# Altium project CGRA_Board_2.PrjPcb (part 2 of 3)

## Sheet USB.SchDoc
size B; Organization: Altium Limited; Address1: L3, 12a Rodborough Rd; Address2: Frenchs Forest; Address3: NSW; Address4: Australia 2086
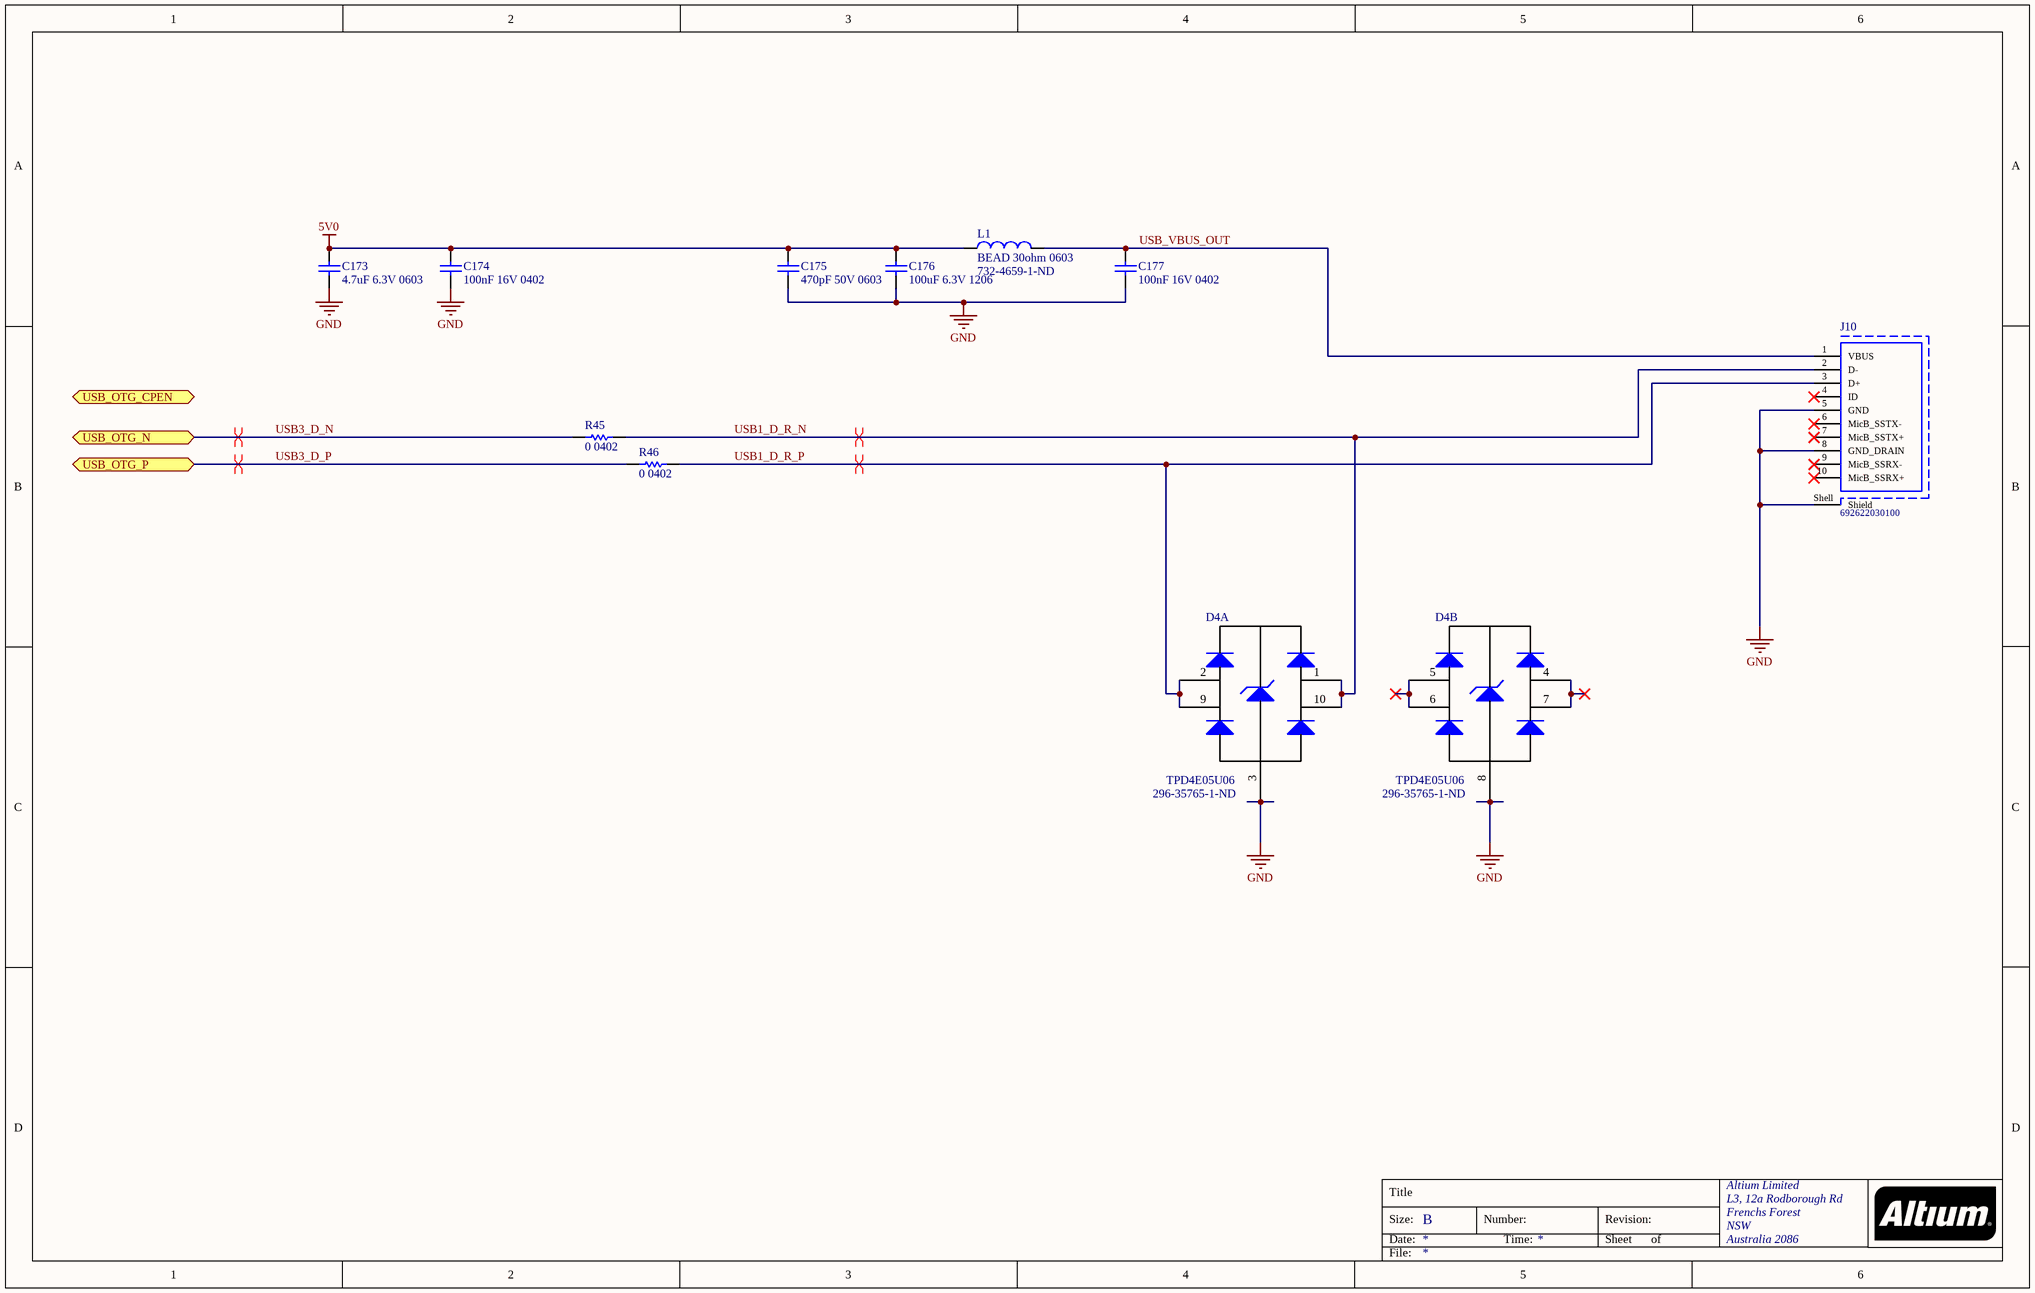
[diagram p7: USB.SchDoc]

### Parts
C173  4.7uF 6.3V 0603  [CAPC0603(1608)55_M]
C174  100nF 16V 0402  [CAPC0402(1005)60_M]
C175  470pF 50V 0603  [CAPC0603(1608)100_M]
C176  100uF 6.3V 1206  [CAPC1206(3216)190_L]
C177  100nF 16V 0402  [CAPC0402(1005)60_M]
D4  TPD4E05U06  Supplier Part Number 1: 296-35765-1-ND  [TI R-PUSON-N10]  (parts A,B of 2)
J10  692622030100  [692622030100]
L1  BEAD 30ohm 0603  Supplier Part Number 1: 732-4659-1-ND  [WE BEAD 0603 INDC1608X10N]
R45  0 0402  [RESC0402(1005)_N]
R46  0 0402  [RESC0402(1005)_N]

### Ports
USB_OTG_CPEN (bidir), USB_OTG_N (bidir), USB_OTG_P (bidir)

### Nets
5V0: C173.2 C174.2 C175.2 C176.2 L1.1
GND: C173.1 C174.1 C175.1 C176.1 C177.1 D4.3 D4.8 J10.5(GND) J10.8(GND_DRAIN) J10.Shell(Shield)
USB1_D_R_N: D4.1 D4.10 J10.2(D-) R45.2
USB1_D_R_P: D4.2 D4.9 J10.3(D+) R46.2
USB3_D_N: R45.1 ; port USB_OTG_N
USB3_D_P: R46.1 ; port USB_OTG_P
USB_VBUS_OUT: C177.2 J10.1(VBUS) L1.2
NetD4_4: D4.4 D4.7
NetD4_5: D4.5 D4.6

Not connected (* = marked no-connect by the designer): J10 4(ID)* 6(MicB_SSTX-)* 7(MicB_SSTX+)* 9(MicB_SSRX-)* 10(MicB_SSRX+)*

### Layout directives
differential pair: USB1_D_R_N, USB1_D_R_P, USB3_D_N, USB3_D_P

### Notes on the sheet
- Title
- Size:
- Date:
- B
- Number:
- Time:
- Revision:
- Sheet
- of
- File:

### Library data of the parts
C173 = CMP-1035-02779-1: CAP 4.7uF 6.3V ±10% 0603 (1608 Metric) Thickness 0.55mm SMD; Case-Metric: 1608; Case-EIA: 0603; Tolerance: Â±10%; Technology: SMT; Value: 4.7uF; Max Thickness: 0.55 mm; Rated Voltage: 6.3 V
C174 C177 = CMP-1034-02069-1: CAP 100nF 16V ±10% 0402 (1005 Metric) Thickness 0.6mm SMD; Case-EIA: 0402; Case-Metric: 1005; Tolerance: Â±10%; Value: 100nF; Max Thickness: 0.6 mm; Rated Voltage: 16 V; Technology: SMT
C175 = CMP-1035-01675-1: CAP 470pF 50V ±5% 0603 (1608 Metric) Thickness 1mm SMD; Case-Metric: 1608; Tolerance: Â±5%; Case-EIA: 0603; Technology: SMT; Rated Voltage: 50 V; Max Thickness: 1 mm; Value: 470pF
C176 = CMP-1037-05005-1: CAP 100uF 6.3V ±20% 1206 (3216 Metric) Thickness 1.9mm SMD; Tolerance: Â±20%; Case-EIA: 1206; Case-Metric: 3216; Technology: SMT; Max Thickness: 1.9 mm; Rated Voltage: 6.3 V; Value: 100uF
D4 = TPD4E05U06: 4-Channel ESD Protection Diode; Supplier 1: Digi-Key
J10 = CMP-1502-03225-1: Micro USB 3.0 Type B Receptacle WR-COM, Horizontal, SMT, with Pads; Manufacturer: Wurth Elektronik; Contact Resistance: 50mOhm; Rated Current: 0.25A; Working Voltage: 30VAC; Manufacturer URL: http://www.we-online.de; Connector Type: MicroUSB3.0TypeB; Gender: Receptacle; Part Number: 692622030100; Mounting Technology: SMT; Packaging: TapeandReel; Publisher: WurthElektronik; Orientation: Horizontal; Package Reference: 692622030100; Operating Temperature: -20to85degC; Datasheet URL: https://katalog.we-online.de/em/datasheet/692622030100.pdf
L1 = BEAD 30ohm 0603: Ferrite bead, 30ohm @ 100MHz; Supplier 1: Digi-Key
R45 R46 = CMP-1011-00001-1: Jumper 0402 (1005 Metric); Tolerance: None; Case-Metric: 1005; Case-EIA: 0402; Value: 0.00 Ohm; Power: None; Technology: SMT

## Sheet ETH_microSD.SchDoc
size B; Organization: Altium Limited; Address1: L3, 12a Rodborough Rd; Address2: Frenchs Forest; Address3: NSW; Address4: Australia 2086
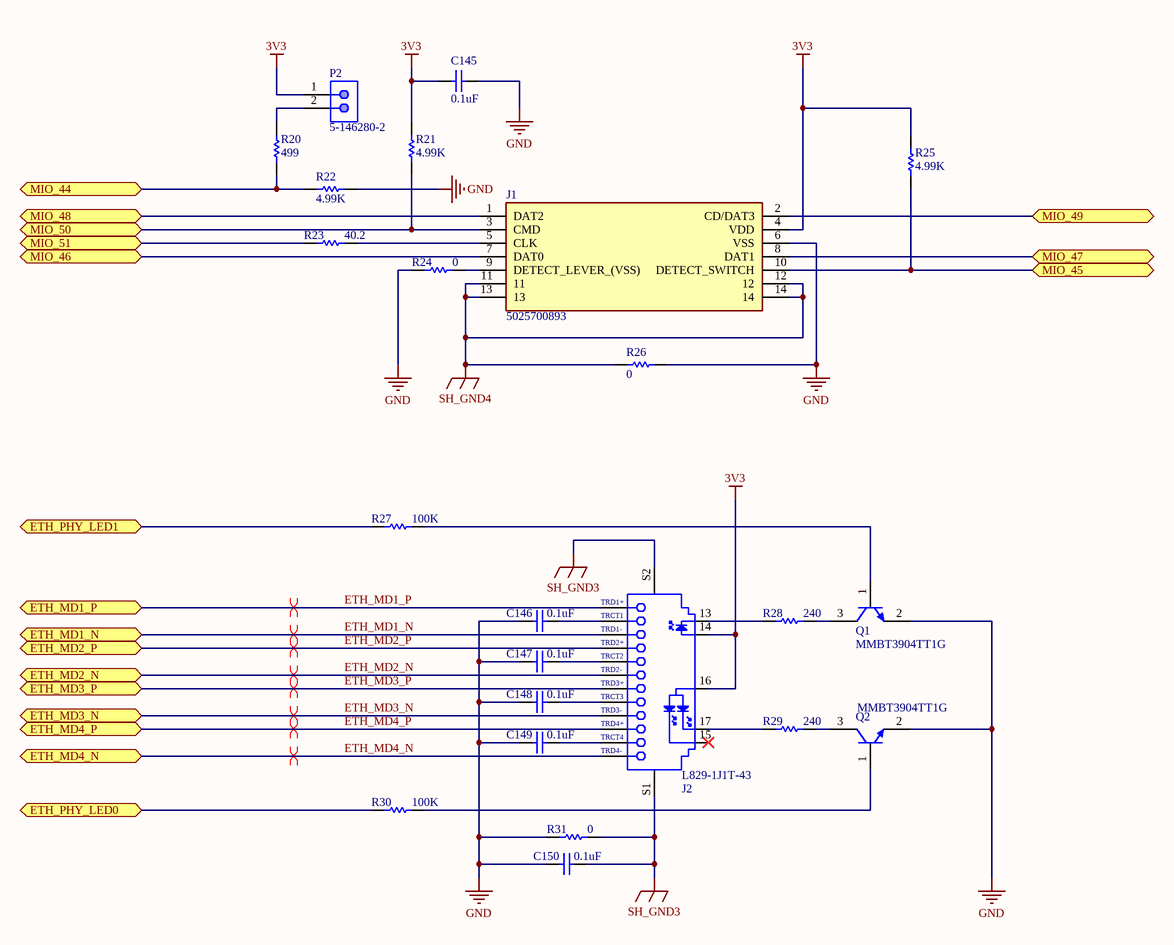
[diagram p8: ETH_microSD.SchDoc]

### Parts
C145  0.1uF  [CAPC0201(0603)33_N]
C146  0.1uF  [CAPC0201(0603)33_N]
C147  0.1uF  [CAPC0201(0603)33_N]
C148  0.1uF  [CAPC0201(0603)33_N]
C149  0.1uF  [CAPC0201(0603)33_N]
C150  0.1uF  [CAPC0201(0603)33_N]
J1  5025700893  [5025700893]
J2  L829-1J1T-43  [BELS-L829-1J1T-43_V]
P2  5-146280-2  [TECO-5-146280-2_V]
Q1  MMBT3904TT1G  [ONSC-SC-75-3-463-01_V]
Q2  MMBT3904TT1G  [ONSC-SC-75-3-463-01_V]
R20  499  [RESC0402(1005)_N]
R21  4.99K  [RESC0402(1005)_N]
R22  4.99K  [RESC0402(1005)_N]
R23  40.2  [RESC0402(1005)_N]
R24  0  [RESC0402(1005)_N]
R25  4.99K  [RESC0402(1005)_N]
R26  0  [RESC0402(1005)_N]
R27  100K  [RESC0402(1005)_N]
R28  240  [RESC0402(1005)_N]
R29  240  [RESC0402(1005)_N]
R30  100K  [RESC0402(1005)_N]
R31  0  [RESC0402(1005)_N]

### Ports
ETH_MD1_N (bidir), ETH_MD1_P (bidir), ETH_MD2_N (bidir), ETH_MD2_P (bidir), ETH_MD3_N (bidir), ETH_MD3_P (bidir), ETH_MD4_N (bidir), ETH_MD4_P (bidir), ETH_PHY_LED0 (bidir), ETH_PHY_LED1 (bidir), MIO_44 (bidir), MIO_45 (bidir), MIO_46 (bidir), MIO_47 (bidir), MIO_48 (bidir), MIO_49 (bidir), MIO_50 (bidir), MIO_51 (bidir)

### Nets
3V3: C145.1 J1.4(VDD) J2.14 J2.16 P2.1 R21.2 R25.2
GND: C145.2 C146.1 C147.1 C148.1 C149.1 C150.1 J1.6(VSS) Q1.2(E) Q2.2(E) R22.2 R24.1 R26.2 R31.1
SH_GND3: C150.2 J2.S1 J2.S2 R31.2
SH_GND4: J1.11 J1.12 J1.13 J1.14 R26.1
ETH_MD1_N: J2.3(TRD1-) ; port ETH_MD1_N
ETH_MD1_P: J2.1(TRD1+) ; port ETH_MD1_P
ETH_MD2_N: J2.6(TRD2-) ; port ETH_MD2_N
ETH_MD2_P: J2.4(TRD2+) ; port ETH_MD2_P
ETH_MD3_N: J2.9(TRD3-) ; port ETH_MD3_N
ETH_MD3_P: J2.7(TRD3+) ; port ETH_MD3_P
ETH_MD4_N: J2.12(TRD4-) ; port ETH_MD4_N
ETH_MD4_P: J2.10(TRD4+) ; port ETH_MD4_P
NetC146_2: C146.2 J2.2(TRCT1)
NetC147_2: C147.2 J2.5(TRCT2)
NetC148_2: C148.2 J2.8(TRCT3)
NetC149_2: C149.2 J2.11(TRCT4)
NetJ1_1: J1.1(DAT2) ; port MIO_48
NetJ1_2: J1.2(CD/DAT3) ; port MIO_49
NetJ1_3: J1.3(CMD) R21.1 ; port MIO_50
NetJ1_5: J1.5(CLK) R23.2
NetJ1_7: J1.7(DAT0) ; port MIO_46
NetJ1_8: J1.8(DAT1) ; port MIO_47
NetJ1_9: J1.9(DETECT_LEVER_(VSS)) R24.2
NetJ1_10: J1.10(DETECT_SWITCH) R25.1 ; port MIO_45
NetJ2_13: J2.13 R28.1
NetJ2_17: J2.17 R29.1
NetJ8_52: R27.1 ; port ETH_PHY_LED1
NetJ8_53: R30.1 ; port ETH_PHY_LED0
NetJ8_93: R20.1 R22.1 ; port MIO_44
NetJ8_100: R23.1 ; port MIO_51
NetP2_2: P2.2 R20.2
NetQ1_1: Q1.1(B) R27.2
NetQ1_3: Q1.3(C) R28.2
NetQ2_1: Q2.1(B) R30.2
NetQ2_3: Q2.3(C) R29.2

Not connected (* = marked no-connect by the designer): J2 15*

### Layout directives
differential pair: ETH_MD1_N, ETH_MD1_P, ETH_MD2_N, ETH_MD2_P, ETH_MD3_N, ETH_MD3_P, ETH_MD4_N, ETH_MD4_P

### Notes on the sheet
- Title
- Size:
- Date:
- B
- Number:
- Time:
- Revision:
- Sheet
- of
- File:

### Library data of the parts
C145-C150 = CAP_0201
J1 = 5025700893: Connector; Manufacturer_Name: Molex; Datasheet Link: https://www.molex.com/pdm_docs/sd/5025700893_sd.pdf; Height: 1mm; Manufacturer_Part_Number: 5025700893
J2 = CMP-1715-00001-1: Gigabit MagJack(R) Ultra Low Profile, 10/100/1000 Base-T, 19-Pin THD, RoHS, Tray; Width: 24.13 mm; RoHSCompliant: True; PartNumber: L829-1J1T-43; Case/Package: Metal; Mount: Through Hole; ComponentLink1Description: Manufacturer URL; Height: 11.3 mm; Package Quantity: 60; Packaging: Tray; Length: 17.78 mm; PackageDescription: 19-Pin Through Hole Device, Body 23.94 x 17.58 mm, Pitch 2.03 mm; ComponentLink2URL: http://belfuse.com/pdfs/L829-1J1T-43.pdf; ComponentLink1URL: http://belfuse.com/ethernet/; Mounting Technology: Through Hole; DatasheetVersion: Rev. G; Pins: 8; ComponentLink2Description: Datasheet
P2 = CMP-2000-07492-1: Male Header, Pitch 2.54 mm, 1 x 2 Position, Height 8.21 mm, Tail Length 3.05 mm, -65 to 105 degC, RoHS, Bulk; Manufacturer: TE Connectivity; Mating Connector Lock: No(Without); Number of Positions: 2; Pitch: 2.54mm; PCB Mounting Orientation: Vertical; Keyed: No; Case\/Package: 100; Mating Post Length: 0.23inch; High Temperature Housing: Yes; Max Current Rating: 5A; PCB Thickness: 0.063inch; PCB Mount Retention: Without; Approvals: CSA; Current Rating: 3A; Radiation Hardening: No; Length: 4.67mm; Contact Mating Length: 0.23inch; Connector Type: Header; Number of Rows: 1; Termination Post Length: 0.12inch; Board Standoff: No(Without); Max Operating Temperature: 105degC; Contact Shape: Square; Selectively Loaded: No(Without); Gasket: No(Without); Number of Contacts: 2; Contact Gender: Male; Mating Alignment: No(Without); Manufacturer URL: http://www.te.com/; Datasheet URL: http://www.te.com/commerce/DocumentDelivery/DDEController?Action=showdoc&DocId=Customer+Drawing%7F146280%7FH1%7Fpdf%7FEnglish%7FENG_CD_146280_H1.pdf%7F5-146280-2; Mount: ThroughHole; Orientation: Straight; Packaging: Carton; Package Reference: 5-146280-2; Package Quantity: 500; Stabilizers: No(Without); Row Spacing: 2.54mm; Contact Material: CopperAlloy; Panel Mount Retention: No(Without); Datasheet Version: Rev. H1, 08/2016; Housing Colour: Black; Colour: Black; Package Description: Male Header, Pitch 2.54 mm, 1 x 2 Position, Height 8.21 mm, Tail Length 3.05 mm; Contact Plating: Matte; Housing Material: Polymer; Contact Protection: No(Without); Min Operating Temperature: -65degC; Mounting Technology: ThroughHole; Flammability Rating: UL94V-0; RoHSCompliant: true; Termination: ThroughHole; Depth: 2.34mm; High Speed Serial Data Connector: No
Q1 Q2 = CMP-1048-00420-1: General Purpose Transistor, NPN Silicon, 3-Pin SC-75, Pb-Free, Tape and Reel; Manufacturer: On Semiconductor; IC Continuous (A): 0.2; fT Min (MHz): 300; ComponentLink3URL: http://www.onsemi.com/pub_link/Collateral/463-01.PDF; DatasheetVersion: Rev. 5; RoHS: TRUE; Mounting Technology: Surface Mount; ComponentLink1URL: http://www.onsemi.com/; ComponentLink3Description: Package Specification; PackageReference: SC-75-3-463-01; Polarity: NPN; ComponentLink2Description: Datasheet; PackageVersion: Rev. F, 07/2005; PartNumber: MMBT3904TT1G; ComponentLink2URL: http://www.onsemi.cn/pub_link/Collateral/MMBT3904TT1-D.PDF; ComponentLink1Description: Manufacturer URL; PackageDescription: 3-Pin Small Outline Transistor, Body 1.6 x 0.8 mm, Pitch 0.5 mm; Packing: Tape and Reel
R20-R31 = RES_0402

## Sheet Display_port.SchDoc
size B; Organization: Altium Limited; Address1: L3, 12a Rodborough Rd; Address2: Frenchs Forest; Address3: NSW; Address4: Australia 2086
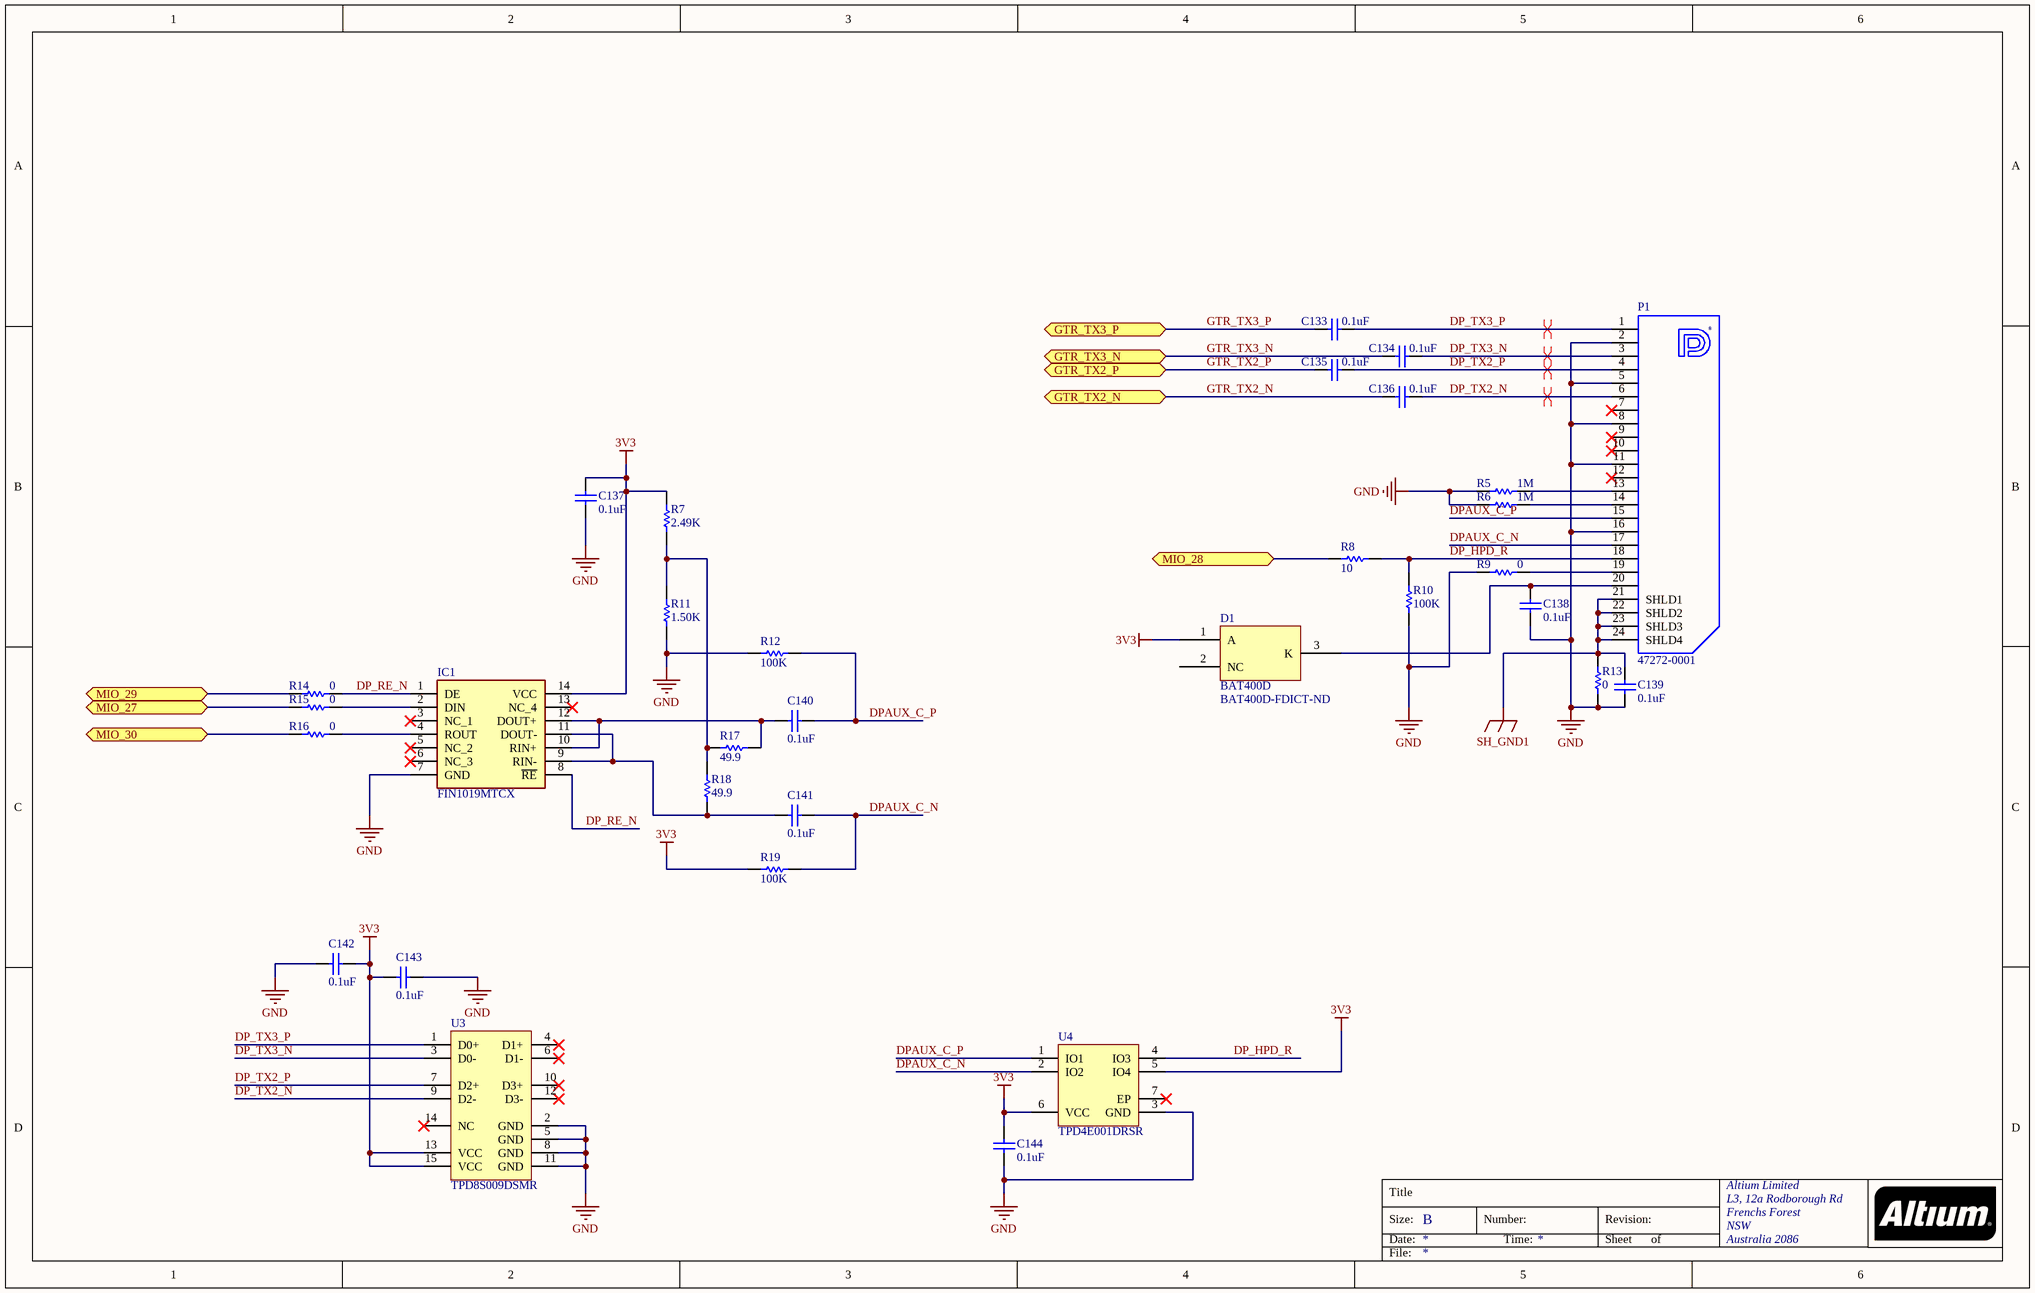
[diagram p9: Display_port.SchDoc]

### Parts
C133  0.1uF  [CAPC0201(0603)33_N]
C134  0.1uF  [CAPC0201(0603)33_N]
C135  0.1uF  [CAPC0201(0603)33_N]
C136  0.1uF  [CAPC0201(0603)33_N]
C137  0.1uF  [CAPC0201(0603)33_N]
C138  0.1uF  [CAPC0201(0603)33_N]
C139  0.1uF  [CAPC0201(0603)33_N]
C140  0.1uF  [CAPC0201(0603)33_N]
C141  0.1uF  [CAPC0201(0603)33_N]
C142  0.1uF  [CAPC0201(0603)33_N]
C143  0.1uF  [CAPC0201(0603)33_N]
C144  0.1uF  [CAPC0201(0603)33_N]
D1  BAT400D  Supplier Part Number 1: BAT400D-FDICT-ND  [SOT95P236X110-3N]
IC1  FIN1019MTCX  [SOP65P640X120-14N]
P1  47272-0001  [MOLX-47272-0001_V]
R5  1M  [RESC0402(1005)_N]
R6  1M  [RESC0402(1005)_N]
R7  2.49K  [RESC0402(1005)_N]
R8  10  [RESC0402(1005)_N]
R9  0  [RESC0402(1005)_N]
R10  100K  [RESC0402(1005)_N]
R11  1.50K  [RESC0402(1005)_N]
R12  100K  [RESC0402(1005)_N]
R13  0  [RESC0402(1005)_N]
R14  0  [RESC0402(1005)_N]
R15  0  [RESC0402(1005)_N]
R16  0  [RESC0402(1005)_N]
R17  49.9  [RESC0402(1005)_N]
R18  49.9  [RESC0402(1005)_N]
R19  100K  [RESC0402(1005)_N]
U3  TPD8S009DSMR  [DSM0015A_V]
U4  TPD4E001DRSR  [DRS0006A_V]

### Ports
GTR_TX2_N (bidir), GTR_TX2_P (bidir), GTR_TX3_N (bidir), GTR_TX3_P (bidir), MIO_27 (bidir), MIO_28 (bidir), MIO_29 (bidir), MIO_30 (bidir)

### Nets
3V3: C137.2 C142.1 C143.2 C144.2 D1.1(A) IC1.14(VCC) R7.2 R19.2 U3.13(VCC) U3.15(VCC) U4.5(IO4) U4.6(VCC)
GND: C137.1 C138.1 C139.1 C142.2 C143.1 C144.1 IC1.7(GND) P1.2 P1.5 P1.8 P1.11 P1.16 R5.1 R6.1 R9.1 R10.1 R11.1 R12.2 R13.2 U3.2(GND) U3.5(GND) U3.8(GND) U3.11(GND) U4.3(GND)
SH_GND1: C139.2 P1.21(SHLD1) P1.22(SHLD2) P1.23(SHLD3) P1.24(SHLD4) R13.1
DP_HPD_R: P1.18 R8.2 R10.2 U4.4(IO3)
DP_RE_N: IC1.1(DE) IC1.8(~{RE}) R14.1
DP_TX2_N: C136.2 P1.6 U3.9(D2-)
DP_TX2_P: C135.2 P1.4 U3.7(D2+)
DP_TX3_N: C134.2 P1.3 U3.3(D0-)
DP_TX3_P: C133.2 P1.1 U3.1(D0+)
DPAUX_C_N: C141.2 P1.17 R19.1 U4.2(IO2)
DPAUX_C_P: C140.2 P1.15 R12.1 U4.1(IO1)
GTR_TX2_N: C136.1 ; port GTR_TX2_N
GTR_TX2_P: C135.1 ; port GTR_TX2_P
GTR_TX3_N: C134.1 ; port GTR_TX3_N
GTR_TX3_P: C133.1 ; port GTR_TX3_P
NetC138_2: C138.2 D1.3(K) P1.20
NetC140_1: C140.1 IC1.10(RIN+) IC1.12(DOUT+) R17.1
NetC141_1: C141.1 IC1.9(RIN-) IC1.11(DOUT-) R18.2
NetIC1_2: IC1.2(DIN) R15.1
NetIC1_4: IC1.4(ROUT) R16.1
NetJ8_70: R15.2 ; port MIO_27
NetJ8_71: R8.1 ; port MIO_28
NetJ8_72: R14.2 ; port MIO_29
NetJ8_73: R16.2 ; port MIO_30
NetP1_13: P1.13 R5.2
NetP1_14: P1.14 R6.2
NetP1_19: P1.19 R9.2
NetR7_1: R7.1 R11.2 R17.2 R18.1

Not connected (* = marked no-connect by the designer): D1 2(NC); IC1 3(NC_1)* 5(NC_2)* 6(NC_3)* 13(NC_4)*; P1 7* 9* 10* 12*; U3 4(D1+)* 6(D1-)* 10(D3+)* 12(D3-)* 14(NC)*; U4 7(EP)*

### Layout directives
differential pair: DP_TX2_N, DP_TX2_P, DP_TX3_N, DP_TX3_P

### Notes on the sheet
- Title
- Size:
- Date:
- B
- Number:
- Time:
- Revision:
- Sheet
- of
- File:
- (in symbol CMP-2000-05608-1) ®

### Library data of the parts
C133-C144 = CAP_0201
IC1 = FIN1019MTCX: Integrated Circuit; Manufacturer_Name: Fairchild Semiconductor; Datasheet Link: http://media.digikey.com/pdf/Data%20Sheets/Fairchild%20PDFs/FIN1019.pdf; Height: 1.2mm; Manufacturer_Part_Number: FIN1019MTCX; Mouser Part Number: 512-FIN1019MTCX; Mouser Price/Stock: https://www.mouser.com/Search/Refine.aspx?Keyword=512-FIN1019MTCX; RS Part Number: 8070805P; RS Price/Stock: http://uk.rs-online.com/web/p/products/8070805P
P1 = CMP-2000-05608-1: DisplayPort Connector, Pitch 0.5 mm, 1 x 20 Position, Height 6.65 mm, -20 to 85 degC, RoHS, Tape and Reel; Manufacturer: Molex; No. of Mating Cycles: 10000; Contact Resistance Max: 50mohm; Connector Mounting: PCB; Mating Force: 44.1N; Withstand Voltage: 500V; Voltage Rating V AC: 40V; Insulation Resistance: 10Mohm; Current Max: 0.5A; Gender: Receptacle; Contact Termination: SurfaceMountRightAngle; Mounting Orientation: Horizontal; De-mating Force: 9.8N; Contact Resistance: 30mohm; Pitch Spacing: 0.50mm; No. of Contacts: 20; Manufacturer URL: http://www.molex.com/; Datasheet Version: Rev. F, 06/2009; Package Description: DisplayPort Connector, Pitch 0.5 mm, 1 x 20 Position, Height 6.65 mm; Connector Type: DisplayPort; Package Reference: 47272-0001; Lead Spacing: 0.5mm; Datasheet URL: http://www.molex.com/pdm_docs/sd/472720001_sd.pdf; Operating Temperature Max: +85°C; Series: 47272; Flammability Rating: UL94V-0; Contact Plating: Gold; Operating Temperature Min: -20°C; Mounting Technology: SurfaceMount; Contact Material: CopperAlloy
R5-R19 = RES_0402
U3 = CMP-0326-00039-2: ESD Solution for HDMI / DisplayPort, 8 Channels, -40 to +85 degC, 15-pin SON (DSM); Manufacturer: Texas Instruments; Eco-Plan: TBD; IEC 61000-4-2 Air-Gap(+/- kV): 9; IO Capacitance(Typ)(pF): 0.8; IO Leakage Current(nA): 10; IEC 61000-4-2 Contact(+/- kV): 8; Differential Capacitance(pF): 0.05; ComponentLink1Description: Manufacturer URL; ComponentLink2URL: http://www.ti.com/general/docs/lit/getliterature.tsp?genericPartNumber=TPD8S009&fileType=pdf; PackageDescription: 15-Pin Plastic Small Outline Flat No-Lead, 2.5 x 6.5 x 0.8 mm Body, 0.5/1.5 mm Pitch; PackageReference: DSM0015A; ComponentLink2Description: Datasheet; PackageVersion: revA, Aug-2007; DatasheetVersion: SLVS816; SubFamily: ESD Solution; Breakdown Voltage(Min)(V): 9; Mounting Technology: Surface Mount; ComponentLink1URL: http://www.ti.com/; PartNumber: TPD8S009DSMR; ComponentLink3URL: SamplesURL:http://www.ti.com/product/tpd8s009#samples; ComponentLink3Description: URL Link1
U4 = CMP-0326-00041-3: Low-Capacitance + / - 15-kV ESD Protection Array for High-Speed Data Interfaces, 4 Channels, -40 to +85 degC, 6-pin SON (DRS), Green (RoHS & no Sb/Br); Manufacturer: Texas Instruments; IO Capacitance(Typ)(pF): 1.5; Breakdown Voltage(Min)(V): 11; Serial ATA / eSATA: TRUE; IEC 61000-4-2 Air-Gap(+/- kV): 15; SubFamily: ESD Solution; IEC 61000-4-2 Contact(+/- kV): 8; ComponentLink1URL: http://www.ti.com/; Eco-Plan: Green (RoHS & no Sb/Br); ComponentLink1Description: Manufacturer URL; PartNumber: TPD4E001DRSR; ComponentLink3Description: URL Link1; Mounting Technology: Surface Mount; PackageDescription: 6-Pin Plastic Small Outline No-Lead, 3 x 3 x 0.8 mm Body, 0.95 mm Pitch; ComponentLink3URL: SamplesURL:http://www.ti.com/product/tpd4e001#samples; 1394 / Firewire: TRUE; PackageVersion: revF, Jul-2011; PackageReference: DRS0006A; USB High Speed: TRUE; ComponentLink2Description: Datasheet; IO Leakage Current(nA): 1.5; ComponentLink2URL: http://www.ti.com/general/docs/lit/getliterature.tsp?genericPartNumber=TPD4E001&fileType=pdf; DatasheetVersion: SLLS682G
D1 = BAT400D: Supplier 1: Digi-Key

## Sheet Power_subsystem.SchDoc
size B; Organization: Altium Limited; Address1: L3, 12a Rodborough Rd; Address2: Frenchs Forest; Address3: NSW; Address4: Australia 2086
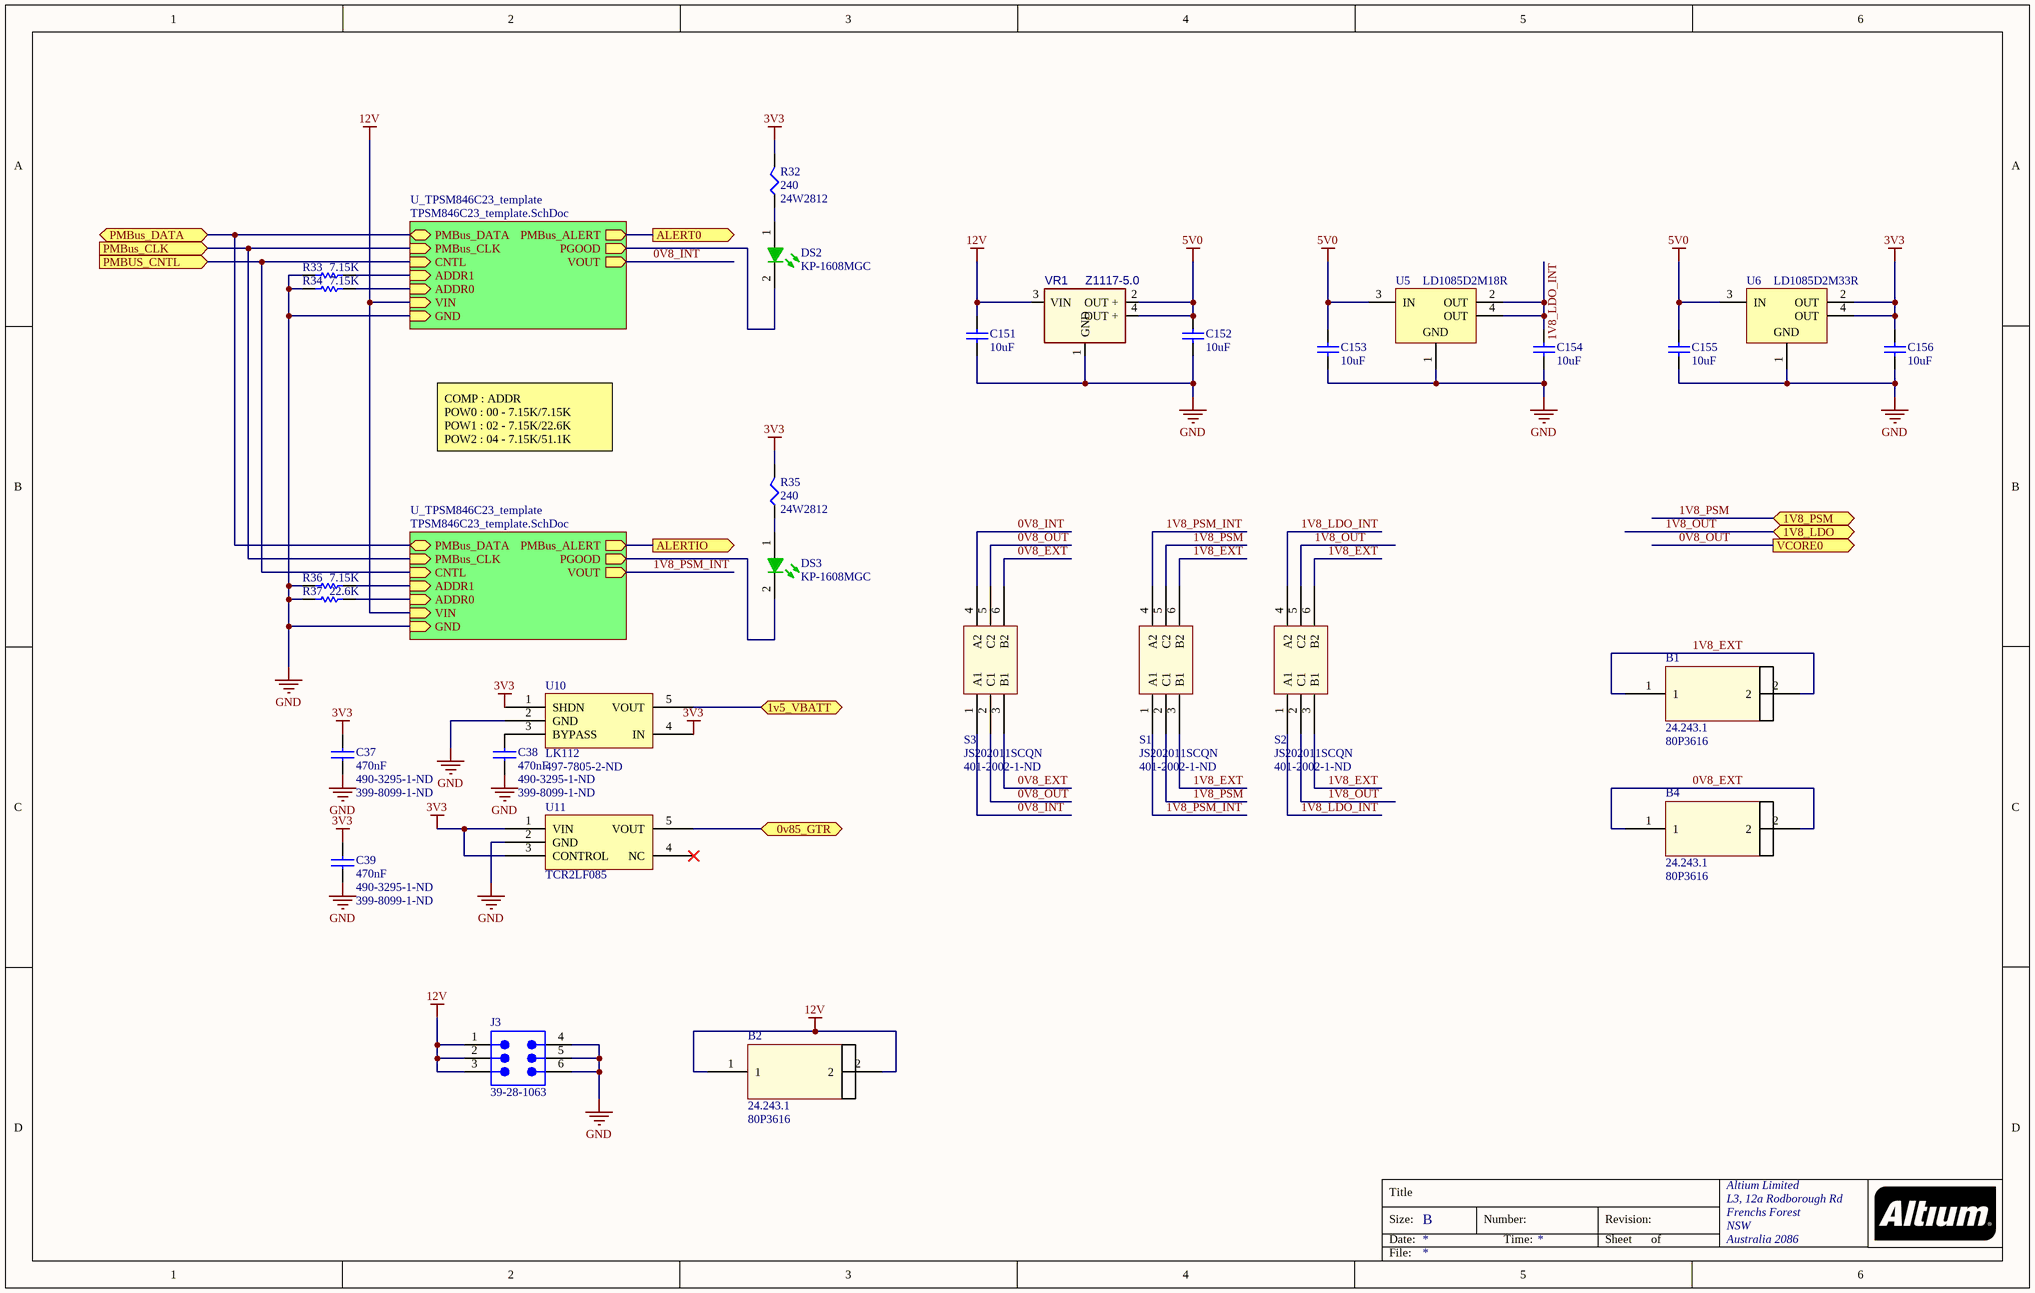
[diagram p10: Power_subsystem.SchDoc]

### Parts
B1  24.243.1  Supplier Part Number 1: 80P3616  [banana_clip]
B2  24.243.1  Supplier Part Number 1: 80P3616  [banana_clip]
B4  24.243.1  Supplier Part Number 1: 80P3616  [banana_clip]
C37  Capacitance: 470nF  Supplier Part Number 1: 490-3295-1-ND  Supplier Part Number 2: 399-8099-1-ND  [CAPC1005X06N]  (hidden comment: CAP_470nF_1608mm_0603mil_1)
C38  Capacitance: 470nF  Supplier Part Number 1: 490-3295-1-ND  Supplier Part Number 2: 399-8099-1-ND  [CAPC1005X06N]  (hidden comment: CAP_470nF_1608mm_0603mil_1)
C39  Capacitance: 470nF  Supplier Part Number 1: 490-3295-1-ND  Supplier Part Number 2: 399-8099-1-ND  [CAPC1005X06N]  (hidden comment: CAP_470nF_1608mm_0603mil_1)
C151  10uF  [CAPC0805(2012)145_N]
C152  10uF  [CAPC0805(2012)145_N]
C153  10uF  [CAPC0805(2012)145_N]
C154  10uF  [CAPC0805(2012)145_N]
C155  10uF  [CAPC0805(2012)145_N]
C156  10uF  [CAPC0805(2012)145_N]
DS2  KP-1608MGC  [KING-0603LED_GREEN_V]
DS3  KP-1608MGC  [KING-0603LED_GREEN_V]
J3  39-28-1063  [MOLX-39-28-1063_V]
R32  Resistance: 240  Supplier Part Number 1: 24W2812  [RESC1608X06N]  (hidden comment: RES_240_0603)
R33  7.15K  [RESC0402(1005)_N]
R34  7.15K  [RESC0402(1005)_N]
R35  Resistance: 240  Supplier Part Number 1: 24W2812  [RESC1608X06N]  (hidden comment: RES_240_0603)
R36  7.15K  [RESC0402(1005)_N]
R37  22.6K  [RESC0402(1005)_N]
S1  JS202011SCQN  Supplier Part Number 1: 401-2002-1-ND  [JS202011SCQN_auto]
S2  JS202011SCQN  Supplier Part Number 1: 401-2002-1-ND  [JS202011SCQN_auto]
S3  JS202011SCQN  Supplier Part Number 1: 401-2002-1-ND  [JS202011SCQN_auto]
U5  LD1085D2M18R  [D2PAK_A_M]
U6  LD1085D2M33R  [D2PAK_A_L]
U10  LK112  Supplier Part Number 1: 497-7805-2-ND  [SOT95P280X110-5N]
U11  TCR2LF085  [SOT95P280X110-5N]
VR1  Z1117-5.0  [SOT-223]

### Sub-sheets
U_TPSM846C23_template = TPSM846C23_template.SchDoc: PMBus_DATA (bidir), PMBus_CLK (in), PMBus_ALERT (out), CNTL (in), ADDR1 (in), ADDR0 (in), PGOOD (out), VIN (in), GND (in), VOUT (out)
U_TPSM846C23_template = TPSM846C23_template.SchDoc: PMBus_DATA (bidir), PMBus_CLK (in), PMBus_ALERT (out), CNTL (in), ADDR1 (in), ADDR0 (in), PGOOD (out), VIN (in), GND (in), VOUT (out)

### Ports
0v85_GTR (bidir), 1v5_VBATT (bidir), 1V8_LDO (bidir), 1V8_PSM (bidir), ALERT0 (out), ALERTIO (out), PMBus_CLK (in), PMBUS_CNTL (in), PMBus_DATA (bidir), VCORE0 (out)

### Nets
0V8_OUT: S3.2(C1) S3.5(C2) ; port VCORE0
1V8_OUT: S2.2(C1) S2.5(C2) ; port 1V8_LDO
1V8_PSM: S1.2(C1) S1.5(C2) ; port 1V8_PSM  [project net 1V8_PM]
3V3: C37.1 C39.1 C156.2 R32.1 R35.1 U6.2(OUT) U6.4(OUT) U10.1(SHDN) U10.4(IN) U11.1(VIN) U11.3(CONTROL)
5V0: C152.2 C153.2 C155.2 U5.3(IN) U6.3(IN) VR1.2(OUT_+) VR1.4(OUT_+)
12V: B2.1 B2.2 C151.2 J3.1 J3.2 J3.3 VR1.3(VIN) ; sheet U_TPSM846C23_template/VIN, sheet U_TPSM846C23_template/VIN
GND: C37.2 C38.2 C39.2 C151.1 C152.1 C153.1 C154.1 C155.1 C156.1 J3.4 J3.5 J3.6 R33.1 R34.1 R36.1 R37.1 U5.1(GND) U6.1(GND) U10.2(GND) U11.2(GND) VR1.1(GND) ; sheet U_TPSM846C23_template/GND, sheet U_TPSM846C23_template/GND
0V8_EXT: B4.1 B4.2 S3.3(B1) S3.6(B2)
0V8_INT: S3.1(A1) S3.4(A2) ; sheet U_TPSM846C23_template/VOUT
1V5_VBATT: U10.5(VOUT) ; port 1v5_VBATT
1V8_EXT: B1.1 B1.2 S1.3(B1) S1.6(B2) S2.3(B1) S2.6(B2)
1V8_LDO_INT: C154.2 S2.1(A1) S2.4(A2) U5.2(OUT) U5.4(OUT)
1V8_PSM_INT: S1.1(A1) S1.4(A2) ; sheet U_TPSM846C23_template/VOUT
ALERT0: port ALERT0, sheet U_TPSM846C23_template/PMBus_ALERT
ALERTIO: port ALERTIO, sheet U_TPSM846C23_template/PMBus_ALERT
GTR_VCC: U11.5(VOUT) ; port 0v85_GTR
PICO_MASTER_I2C_SCL: port PMBus_CLK, sheet U_TPSM846C23_template/PMBus_CLK, sheet U_TPSM846C23_template/PMBus_CLK
PICO_MASTER_I2C_SDA: port PMBus_DATA, sheet U_TPSM846C23_template/PMBus_DATA, sheet U_TPSM846C23_template/PMBus_DATA
PMBUS_CNTL: port PMBUS_CNTL, sheet U_TPSM846C23_template/CNTL, sheet U_TPSM846C23_template/CNTL
NetC38_1: C38.1 U10.3(BYPASS)
NetDS2_1: DS2.1(A) R32.2
NetDS2_2: DS2.2(K) ; sheet U_TPSM846C23_template/PGOOD
NetDS3_1: DS3.1(A) R35.2
NetDS3_2: DS3.2(K) ; sheet U_TPSM846C23_template/PGOOD
NetR33_2: R33.2 ; sheet U_TPSM846C23_template/ADDR1
NetR34_2: R34.2 ; sheet U_TPSM846C23_template/ADDR0
NetR36_2: R36.2 ; sheet U_TPSM846C23_template/ADDR1
NetR37_2: R37.2 ; sheet U_TPSM846C23_template/ADDR0

Not connected (* = marked no-connect by the designer): U11 4(NC)*

### Notes on the sheet
- COMP : ADDR
  POW0 : 00 - 7.15K/7.15K
  POW1 : 02 - 7.15K/22.6K
  POW2 : 04 - 7.15K/51.1K
- Title
- Size:
- Date:
- B
- Number:
- Time:
- Revision:
- Sheet
- of
- File:

### Library data of the parts
C37-C39 = CAP_470nF_1608mm_0603mil_1: 0.47uF Capacitor; Manufacturer: Murata; Manufacturer Part Number: GRM155R61E225ME15D; Voltage Rating: 25V; Tolerance: 20%; Dielectric: X5R; ComponentLink1URL: http://search.murata.co.jp/Ceramy/image/img/A01X/G101/ENG/GRM0335C1E120JA01-01.pdf; ComponentLink1Description: http://search.murata.co.jp/Ceramy/image/img/A01X/G101/ENG/GRM0335C1E120JA01-01.pdf; ComponentLink2URL: http://search.murata.co.jp/Ceramy/image/img/A01X/partnumbering_e_01.pdf; ComponentLink2Description: http://search.murata.co.jp/Ceramy/image/img/A01X/partnumbering_e_01.pdf; ComponentLink3URL: http://www1.futureelectronics.com/doc/SAMSUNG/CL03A104KQ3NNNC.pdf; ComponentLink3Description: http://www1.futureelectronics.com/doc/SAMSUNG/CL03A104KQ3NNNC.pdf; ComponentLink4URL: https://www.distrelec.biz/Web/Downloads/_e/ng/MLCC_CatalogDownload2013_ENG.pdf?mime=application%2Fpdf; ComponentLink4Description: https://www.distrelec.biz/Web/Downloads/_e/ng/MLCC_CatalogDownload2013_ENG.pdf?mime=application%2Fpdf; ComponentLink5URL: https://www.verical.com/server-webapp/html/getDatasheet?partID=355266; ComponentLink5Description: https://www.verical.com/server-webapp/html/getDatasheet?partID=355266; ComponentLink6URL: http://psearch.murata.com/capacitor/product/GCM155R71H103KA55%23.pdf; ComponentLink6Description: http://psearch.murata.com/capacitor/product/GCM155R71H103KA55%23.pdf; ComponentLink7URL: https://www.verical.com/server-webapp/html/getDatasheet?partID=27433; ComponentLink7Description: https://www.verical.com/server-webapp/html/getDatasheet?partID=27433; ComponentLink8URL: http://psearch.en.murata.com/capacitor/product/GCM155R71H103KA55%23.pdf; ComponentLink8Description: http://psearch.en.murata.com/capacitor/product/GCM155R71H103KA55%23.pdf; ComponentLink9URL: http://search.murata.co.jp/Ceramy/image/img/A01X/partnumbering_e_02.pdf; ComponentLink9Description: http://search.murata.co.jp/Ceramy/image/img/A01X/partnumbering_e_02.pdf; ComponentLink10URL: http://uk.rs-online.com/webdocs/0ef9/0900766b80ef92d0.pdf; ComponentLink10Description: http://uk.rs-online.com/webdocs/0ef9/0900766b80ef92d0.pdf; Stock 1: 100000; Pricing 1: 1=0.34, 10=0.23, 100=0.1163, 500=0.0796, 1000=0.07041, 2500=0.06735, 5000=0.06123 (USD); Mount: Surface Mount; Case/Package: 0402; Weight: 0.000212oz; Case Code (Metric): 1005; Case Code (Imperial): 0402; Min Operating Temperature: -55°C; Max Operating Temperature: 85°C; Packaging: Tape and Reel; Termination: SMD/SMT; Voltage Rating (DC): 25V; Package Quantity: 10000; Length: 0.039inch; Height: 0.5mm; Width: 0.02inch; Thickness: 0.022inch; Supplier 1: Digi-Key; Supplier 2: Digi-Key
C151-C156 = CAP_0805
DS2 DS3 = CMP-0404-00001-1: LED, SMT, 0603(1608), 1.1mm thickness, Green; Manufacturer: Kingbright; Reverse Voltage: 5 V; Power Dissipation: 75 mW; Forward Current: 30 mA; Packing Type: 2000 pcs / reel; Mounting Technology: Surface Mount; Storage Temperature: -40 to +85 degC; ComponentLink1URL: http://www.kingbright.com/; PackageDescription: 2-Pin SMT LED, 1.6 x 0.8 mm Pitch; PartNumber: KP-1608MGC; PackageReference: 0603LED_GREEN; ComponentLink1Description: Manufacturer URL
J3 = CMP-1594-00001-1: 4.2 mm Pitch Mini-Fit Jr.Power Connector, Vertical, Through Hole, 6 Circuits, -40 to 105 degC, RoHS, Bag; Pitch: 4.2 mm; No. of Positions: 6; No. of Rows: 2; PartNumber: 39-28-1063; ComponentLink3Description: Package Specification; ComponentLink1URL: http://www.molex.com/; PackageVersion: Rev. F, 06/2009; Orientation: Vertical; ComponentLink3URL: http://www.molex.com/pdm_docs/sd/039281063_sd.pdf; ComponentLink2Description: Datasheet; PackageDescription: 6-Pin PCB Header, Vertical, Pitch 4.2 mm, Through Hole; ComponentLink1Description: Manufacturer URL; Temperature Min: -40 degC; RoHS: TRUE; Packing: Bag; Mounting Technology: Through Hole; Temperature Max: 105 degC; ComponentLink2URL: http://www.molex.com/webdocs/datasheets/pdf/en-us/0039281063_PCB_HEADERS.pdf
R32 R35 = RES_240_0603: Res Thin Film 0603 240 Ohm 0.1% 0.1W(1/10W) ±25ppm/C Molded SMD Automotive Punched T/R; Manufacturer: Panasonic; Manufacturer Part Number: ERA-3AEB101V; Power Rating: 100mW; Voltage Rating: 75V; Temperature Coefficient: 25ppm/°C; ComponentLink1URL: https://www.rohm.com/datasheet/ESR01MZPF/esr-e; ComponentLink1Description: https://www.rohm.com/datasheet/ESR01MZPF/esr-e; Stock 1: 511300; Pricing 1: 1=0.35, 10=0.3, 100=0.1172, 1000=0.04906, 2500=0.04498 (USD); Mount: Surface Mount; Case/Package: 0603; Number of Pins: 2; Case Code (Metric): 1608; Case Code (Imperial): 0603; Contact Plating: Tin; Min Operating Temperature: -55°C; Max Operating Temperature: 155°C; Tolerance: 0.1%; Packaging: Tape and Reel; Package Quantity: 5000; Composition: Metal Film,Thin Film; Number of Terminations: 2; Termination: SMD/SMT; Military Standard: Not; Max Power Dissipation: 100mW; Length: 1.6mm; Height: 0.45mm; Width: 0.8mm; Depth: 0.8mm; Radiation Hardening: No; REACH SVHC: No SVHC; ComponentLink2URL: http://www.farnell.com/datasheets/485442.pdf; ComponentLink2Description: http://www.farnell.com/datasheets/485442.pdf; ComponentLink3URL: http://industrial.panasonic.com/www-data/pdf/AOA0000/AOA0000CE26.pdf; ComponentLink3Description: http://industrial.panasonic.com/www-data/pdf/AOA0000/AOA0000CE26.pdf; ComponentLink4URL: http://www.farnell.com/datasheets/2059650.pdf; ComponentLink4Description: http://www.farnell.com/datasheets/2059650.pdf; ComponentLink5URL: http://www.farnell.com/datasheets/39837.pdf; ComponentLink5Description: http://www.farnell.com/datasheets/39837.pdf; ComponentLink6URL: http://uk.rs-online.com/webdocs/0fe2/0900766b80fe20f7.pdf; ComponentLink6Description: http://uk.rs-online.com/webdocs/0fe2/0900766b80fe20f7.pdf; ComponentLink7URL: https://www.alliedelec.com/m/d/b6b0537e86f421aa7f5975bb1d8f429a.pdf; ComponentLink7Description: https://www.alliedelec.com/m/d/b6b0537e86f421aa7f5975bb1d8f429a.pdf; ComponentLink8URL: https://www.distrelec.biz/Web/Downloads/_t/ds/ERA_eng_tds.pdf?mime=application%2Fpdf; ComponentLink8Description: https://www.distrelec.biz/Web/Downloads/_t/ds/ERA_eng_tds.pdf?mime=application%2Fpdf; ComponentLink9URL: http://www.produktinfo.conrad.com/datenblaetter/450000-474999/450355-da-01-en-WIDERSTAND_0603_ERA.pdf; ComponentLink9Description: http://www.produktinfo.conrad.com/datenblaetter/450000-474999/450355-da-01-en-WIDERSTAND_0603_ERA.pdf; Supplier 1: Newark
R33 R34 R36 R37 = RES_0402
U5 = CMP-0244-00504-1: 3A, Low Drop Positive Voltage Regulator, 1.8V, 4-Pin D2PAK/A; PackageVersion: 2011; ComponentLink1Description: Manufacturer URL; PackageReference: D2PAK_A; PackageDescription: 4-Pin Transistor Outline Package 2.54 mm Pitch, 15.4 mm Lead Span; ComponentLink2Description: Datasheet; DatasheetVersion: 28/07/2009; ComponentLink2URL: http://www.st.com/internet/com/TECHNICAL_RESOURCES/TECHNICAL_LITERATURE/DATASHEET/CD00001883.pdf; ComponentLink1URL: http://www.st.com
U6 = CMP-0244-00506-1: 3A, Low Drop Positive Voltage Regulator, 3.3V, 4-Pin D2PAK/A; PackageVersion: 2011; ComponentLink1URL: http://www.st.com; ComponentLink1Description: Manufacturer URL; PackageReference: D2PAK_A; ComponentLink2Description: Datasheet; ComponentLink2URL: http://www.st.com/internet/com/TECHNICAL_RESOURCES/TECHNICAL_LITERATURE/DATASHEET/CD00001883.pdf; PackageDescription: 4-Pin Transistor Outline Package 2.54 mm Pitch, 15.4 mm Lead Span; DatasheetVersion: 28/07/2009
U10 = LK112: 1.5V regulator; ComponentLink1Description: TCR2LF085; ComponentLink1URL: https://www.digikey.com/en/products/detail/toshiba-semiconductor-and-storage/TCR2LF085-LM-CT/10379974; Supplier 1: Digi-Key
U11 = TCR2LF085: 0.85V regulator; ComponentLink1Description: TCR2LF085; ComponentLink1URL: https://www.digikey.com/en/products/detail/toshiba-semiconductor-and-storage/TCR2LF085-LM-CT/10379974
VR1 = ZLDO1117: IC REG LDO 1A SOT223-3; Mfr Part Number: ZLDO1117G50TA; Manufacturer: Diodes; Mfr Part Description: IC REG LDO 5V 1A SOT223-3; ID: 60187; Voltage_Rating: 5V; Updated By: User 3; Sub_Type: Vreg; Part_Type: IC; Value: Z1117-5.0; Supplier 1: Digi-Key; Supplier Part Number 1: ZLDO1117G50DICT-ND; Package_Case: TO-261-4, TO-261AA; RoHS: Yes; Temperature Range: -40C to +125C; Current_Rating: 1A; Created By: murbach; LifeCycle: New; ComponentLink1Description: Datasheets; ComponentLink1URL: http://www.diodes.com/datasheets/ZLDO1117.pdf; ComponentLink2Description: Supplier Part Details; ComponentLink2URL: http://www.digikey.com/product-detail/en/ZLDO1117G50TA/ZLDO1117G50DICT-ND; Created_Date: 2014/11/24 21:28:44; Updated_Date: 2016/06/22 20:05:00
B1 B2 B4 = 24.243.1: Supplier 1: Newark
S1-S3 = JS202011SCQN: Supplier 1: Digi-Key